# EAGLE design PCB (EAGLE 6.6.0)
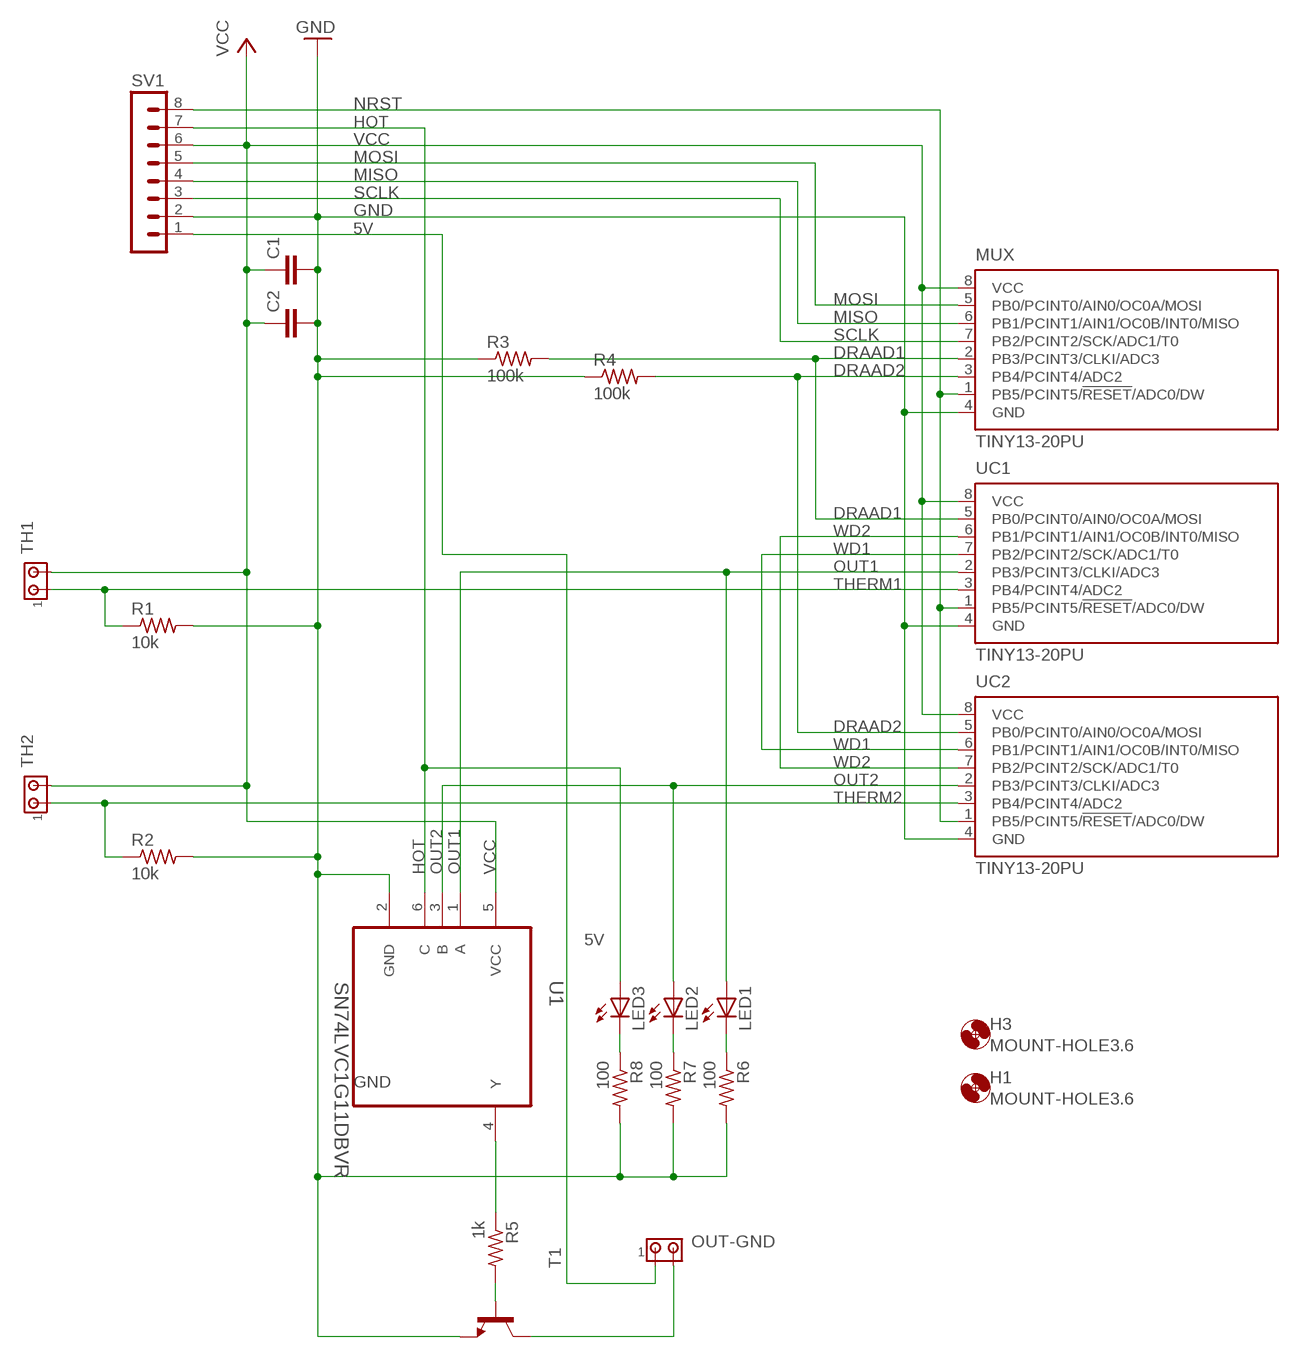
[diagram p0: schematic, sheet 1]

## Parts
C1  C2.5/2  [C2.5-2]
C2  C2.5/2  [C2.5-2]
H1  MOUNT-HOLE3.6  [3,6]
H3  MOUNT-HOLE3.6  [3,6]
LED1  LEDSML0805  [SML0805]
LED2  LEDSML0805  [SML0805]
LED3  LEDSML0805  [SML0805]
MUX  TINY13-20PU  [DIL08]
OUT-GND  MTA02-100  [10X02MTA]
R1  10k  R-US_R0805  [R0805]
R2  10k  R-US_R0805  [R0805]
R3  100k  R-US_R0805  [R0805]
R4  100k  R-US_R0805  [R0805]
R5  1k  R-US_R0805  [R0805]
R6  100  R-US_R0805  [R0805]
R7  100  R-US_R0805  [R0805]
R8  100  R-US_R0805  [R0805]
SV1  MA08-1  [MA08-1]
T1  -NPN-TO126V  [TO126V]
TH1  MTA02-100  [10X02MTA]
TH2  MTA02-100  [10X02MTA]
U1  SN74LVC1G11DBVR  [SOT95P280X145-6N]
UC1  TINY13-20PU  [DIL08]
UC2  TINY13-20PU  [DIL08]

## Nets
5V: OUT-GND.1 SV1.1
DRAAD1: MUX.2(PB3/PCINT3/CLKI/ADC3) R3.2 UC1.5(PB0/PCINT0/AIN0/OC0A/MOSI)
DRAAD2: MUX.3(PB4/PCINT4/ADC2) R4.2 UC2.5(PB0/PCINT0/AIN0/OC0A/MOSI)
GND: C1.2 C2.2 MUX.4(GND) R1.2 R2.2 R3.1 R4.1 R6.2 R7.2 R8.2 SV1.2 T1.1(E) U1.2(GND) UC1.4(GND) UC2.4(GND)
HOT: LED3.A SV1.7 U1.6(C)
MISO: MUX.6(PB1/PCINT1/AIN1/OC0B/INT0/MISO) SV1.4
MOSI: MUX.5(PB0/PCINT0/AIN0/OC0A/MOSI) SV1.5
N$1: OUT-GND.2 T1.2(C)
N$2: LED3.C R8.1
N$3: R5.1 U1.4(Y)
N$4: R5.2 T1.3(B)
N$5: LED2.C R7.1
N$6: LED1.C R6.1
NRST: MUX.1(PB5/PCINT5/!RESET!/ADC0/DW) SV1.8 UC1.1(PB5/PCINT5/!RESET!/ADC0/DW) UC2.1(PB5/PCINT5/!RESET!/ADC0/DW)
OUT1: LED1.A U1.1(A) UC1.2(PB3/PCINT3/CLKI/ADC3)
OUT2: LED2.A U1.3(B) UC2.2(PB3/PCINT3/CLKI/ADC3)
SCLK: MUX.7(PB2/PCINT2/SCK/ADC1/T0) SV1.3
THERM1: R1.1 TH1.1 UC1.3(PB4/PCINT4/ADC2)
THERM2: R2.1 TH2.1 UC2.3(PB4/PCINT4/ADC2)
VCC: C1.1 C2.1 MUX.8(VCC) SV1.6 TH1.2 TH2.2 U1.5(VCC) UC1.8(VCC) UC2.8(VCC)
WD1: UC1.7(PB2/PCINT2/SCK/ADC1/T0) UC2.6(PB1/PCINT1/AIN1/OC0B/INT0/MISO)
WD2: UC1.6(PB1/PCINT1/AIN1/OC0B/INT0/MISO) UC2.7(PB2/PCINT2/SCK/ADC1/T0)

## Library data of the parts
C1 C2 = capacitor-wima:C: CAPACITOR naming: grid - package width
H1 H3 = holes:MOUNT-HOLE: MOUNTING HOLE with drill center marker
LED1-LED3 = led:LED: LED OSRAM: - CHIPLED LG R971, LG N971, LY N971, LG Q971, LY Q971, LO R971, LY R971 LH N974, LH R974 LS Q976, LO Q976, LY Q976 LO Q996 - Hyper CHIPLED LW Q18S LB Q993, LB Q99A, LB R99A - SideLED LS A670, LO A670, LY A670, LG A670, LP A670 LB A673, LV A673, LT A673, LW A673 LH A674 LY A675 LS A676, LA A676, LO A676, LY A676, LW A676 LS A679, LY A679, LG A679 - Hyper Micro SIDELED® LS Y876, LA Y876, LO Y876, LY Y876 LT Y87S - SmartLED LW L88C, LW L88S LB L89C, LB L89S, LG L890 LS L89K, LO L89K, LY L89K LS L896, LA L896, LO L896, LY L896 - TOPLED LS T670, LO T670, LY T670, LG T670, LP T670 LSG T670, LSP T670, LSY T670, LOP T670, LYG T670 LG T671, LOG T671, LSG T671 LB T673, LV T673, LT T673, LW T673 LH T674 LS T676, LA T676, LO T676, LY T676, LB T676, LH T676, LSB T676, LW T676 LB T67C, LV T67C, LT T67C, LS T67K, LO T67K, LY T67K, LW E67C LS E67B, LA E67B, LO E67B, LY E67B, LB E67C, LV E67C, LT E67C LW T67C LS T679, LY T679, LG T679 LS T770, LO T770, LY T770, LG T770, LP T770 LB T773, LV T773, LT T773, LW T773 LH T774 LS E675, LA E675, LY E675, LS T675 LS T776, LA T776, LO T776, LY T776, LB T776 LHGB T686 LT T68C, LB T68C - Hyper Mini TOPLED® LB M676 - Mini TOPLED Santana® LG M470 LS M47K, LO M47K, LY M47K Source: http://www.osram.convergy.de LUXEON: - LUMILED® LXK2-PW12-R00, LXK2-PW12-S00, LXK2-PW14-U00, LXK2-PW14-V00 LXK2-PM12-R00, LXK2-PM12-S00, LXK2-PM14-U00 LXK2-PE12-Q00, LXK2-PE12-R00, LXK2-PE12-S00, LXK2-PE14-T00, LXK2-PE14-U00 LXK2-PB12-K00, LXK2-PB12-L00, LXK2-PB12-M00, LXK2-PB14-N00, LXK2-PB14-P00, LXK2-PB14-Q00 LXK2-PR12-L00, LXK2-PR12-M00, LXK2-PR14-Q00, LXK2-PR14-R00 LXK2-PD12-Q00, LXK2-PD12-R00, LXK2-PD12-S00 LXK2-PH12-R00, LXK2-PH12-S00 LXK2-PL12-P00, LXK2-PL12-Q00, LXK2-PL12-R00 Source: www.luxeon.com KINGBRIGHT: KA-3528ASYC Source: www.kingbright.com
MUX UC1 UC2 = atmel:TINY13: 8-bit AVR Microcontroller with 1K Bytes In-System Programmable Flash Source: http://www.atmel.com/dyn/resources/prod_documents/2535S.pdf; MPN: ATTINY13-20PU; OC_FARNELL: 9171550; OC_NEWARK: 96K6521
OUT-GND TH1 TH2 = con-amp:MTA02-100: AMP connector
R1-R8 = resistor:R-US_: RESISTOR, American symbol
SV1 = parts:MA08-1: PIN HEADER; OC_FARNELL: unknown; OC_NEWARK: unknown
T1 = transistor:*-NPN-: NPN Transistror BF959 corrected 2008.03.06
U1 = parts:SN74LVC1G11DBVR: SINGLE 3-INPUT POSITIVE-AND GATE; MPN: SN74LVC1G11DBVR; OC_FARNELL: 1607825; OC_NEWARK: 87H2655; PACKAGE: SOT-23-6; SUPPLIER: Texas Instruments

## Net classes
0 default: clearance 0.205 mm

## Board
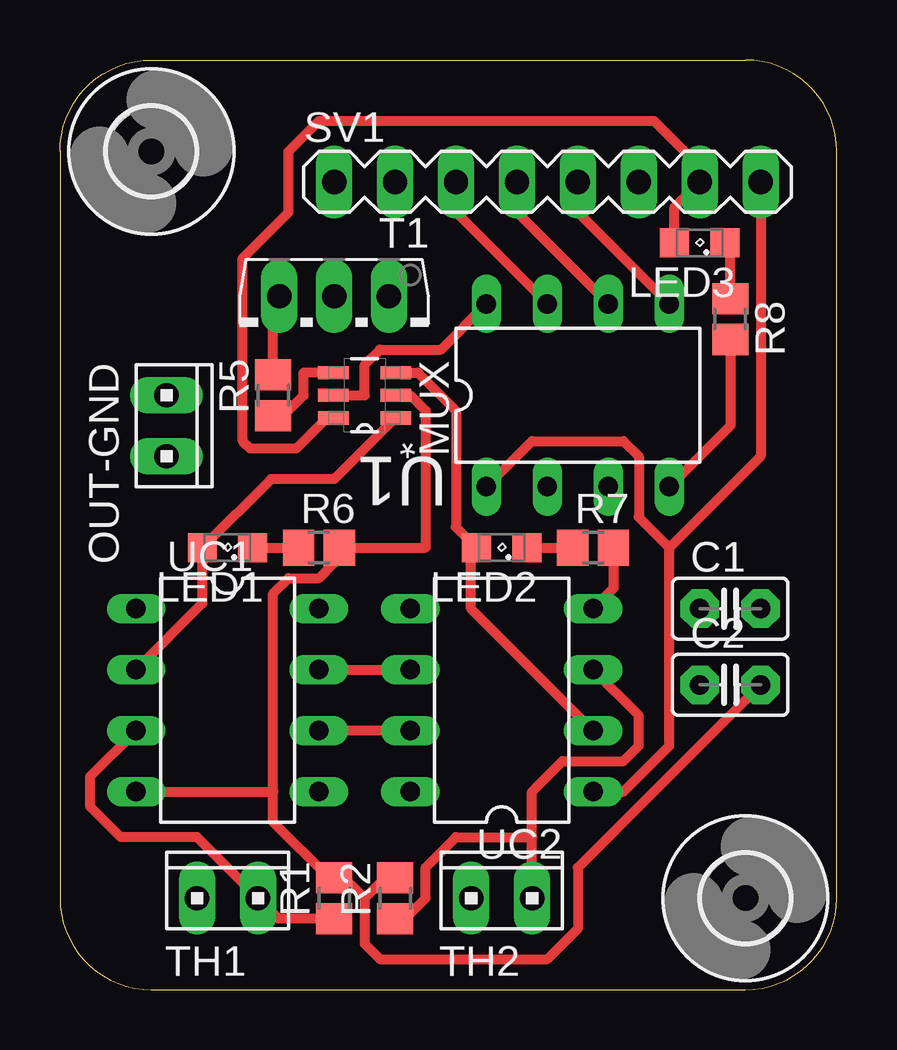
[diagram p1: board, top side]
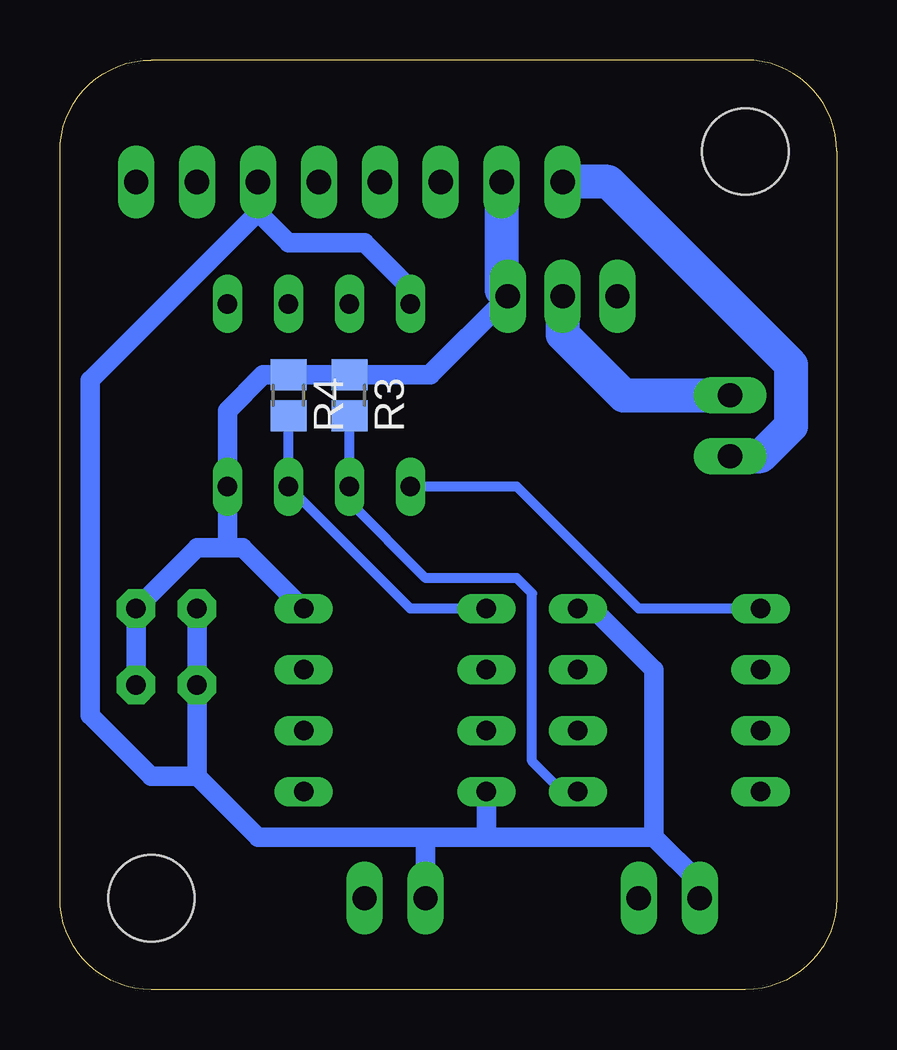
[diagram p2: board, bottom side, seen from below]

Size 32.38 x 38.73 mm. Coordinates in mm from the lower left corner, seen from the top.
Outline: 3.81,0 28.57,0 arc90 32.38,3.81 32.38,34.92 arc90 28.57,38.73 3.81,38.73 arc90 0,34.92 0,3.81 arc90 3.81,0
Copper layers (1*16): Top 0.0356mm / dielectric 1.5011mm / Bottom 0.0356mm
Design rules "oshpark-2layer": minimum track width 6mil, minimum drill 13mil, track to track 6mil, track to pad 6mil, pad to pad 6mil, via to via 6mil, smd to smd 6mil, copper to edge 15mil, drill to drill 6mil, minimum pad ring 7mil, minimum via ring 7mil, stop-mask expansion 2.5mil, vias tented up to drill 0mil, thermal gap 10mil

### Footprints (pad centres in the part's own frame; a part is rotated, then mirrored left to right if it is on the bottom)
C2.5-2 = drill 0.813 pad 1.6 octagon: 1 -1.27,0; 2 1.27,0
3,6 = hole 3.6: 0,0
SML0805 = smd 1.2 x 1.2: A 1.05,0; C -1.05,0
DIL08 = drill 0.813 long: 1 -3.81,-3.81; 2 -1.27,-3.81; 3 1.27,-3.81; 4 3.81,-3.81; 5 3.81,3.81; 6 1.27,3.81; 7 -1.27,3.81; 8 -3.81,3.81
10X02MTA = drill 1.016 long: 1 1.27,0; 2 -1.27,0
R0805 = smd 1.3 x 1.5: 1 -0.85,0; 2 0.85,0
MA08-1 = drill 1.016 long: 1 -8.89,0; 2 -6.35,0; 3 -3.81,0; 4 -1.27,0; 5 1.27,0; 6 3.81,0; 7 6.35,0; 8 8.89,0
TO126V = drill 1.016 long: 1 -2.286,-1.27; 2 0,-1.27; 3 2.286,-1.27
SOT95P280X145-6N = smd 1.27 x 0.559: 1 -1.295,0.94; 2 -1.295,0; 3 -1.295,-0.94; 4 1.295,-0.94; 5 1.295,0; 6 1.295,0.94

### Placement (x,y rotation side)
C1  27.94,15.88 0 top
C2  27.94,12.7 0 top
H1  28.57,3.81 0 top
H3  3.81,34.92 0 top
LED1  6.99,18.41 180 top
LED2  18.41,18.41 180 top
LED3  26.67,31.11 180 top
MUX  21.59,24.77 0 top
OUT-GND  4.45,23.5 270 top
R1  11.43,3.81 90 top
R2  13.97,3.81 90 top
R3  20.32,24.77 270 bottom
R4  22.86,24.77 270 bottom
R5  8.89,24.77 90 top
R6  10.79,18.41 0 top
R7  22.23,18.41 0 top
R8  27.94,27.94 270 top
SV1  20.32,33.66 0 top
T1  11.43,27.62 180 top
TH1  6.99,3.81 0 top
TH2  18.41,3.81 0 top
U1  12.7,24.77 180 top
UC1  6.99,12.06 270 top
UC2  18.41,12.06 90 top

### Tracks (layer width: path | path; a pad name or v marks a point on that pad's centre or on a via)
5V
  Bottom 1.422: OUT-GND.1 3.17,22.23 1.91,23.5 1.91,26.04 9.53,33.66 SV1.1
DRAAD1
  Bottom 0.406: R3.2 MUX.2 20.32,20.32 17.14,17.14 13.34,17.14 12.7,16.51 12.7,9.53 11.43,8.26 UC1.5
DRAAD2
  Bottom 0.406: R4.2 MUX.3 17.78,15.88 UC2.5
GND
  Top 0.406: 11.75,18.52 R6.2 | U1.2 14.61,24.77 15.24,24.13 15.24,18.41 R6.2 | R8.2 27.94,23.5 MUX.4 | R7.2 23.07,16.73 UC2.4 | 8.89,8.26 8.89,6.99 11.21,4.66 R1.2 11.85,4.66 12.7,3.81 | 8.89,8.26 8.89,16.51 9.53,17.14 10.79,17.14 11.43,17.78 11.43,18.2 R6.2 | 12.7,3.81 12.7,1.91 13.34,1.27 20.32,1.27 21.59,2.54 21.59,5.08 C2.2 | 12.7,3.81 13.34,4.45 13.76,4.45 R2.2 | UC1.4 8.89,8.26
  Bottom 0.813: R3.1 16.99,25.61 | 16.99,25.61 T1.1 | R3.1 R4.1 | 25.4,18.41 24.77,18.41 UC2.4 | 25.4,18.41 MUX.4 25.4,24.13 23.91,25.61 R3.1 | 16.99,25.61 16.93,25.61 13.97,28.57 | C2.2 C1.2 26.67,18.41 25.4,18.41
  Bottom 1.422: SV1.2 13.97,29.15 T1.1
HOT
  Top 0.406: U1.6 11.12,23.82 9.84,22.54 7.94,22.54 7.62,22.86 7.62,30.48 9.53,32.38 9.53,34.92 10.79,36.2 24.77,36.2 26.67,34.29 SV1.7 25.62,32.6 LED3.A
MISO
  Top 0.406: SV1.4 19.05,32.38 MUX.6
MOSI
  Top 0.406: SV1.5 21.59,32.38 MUX.5
N$1
  Bottom 1.422: T1.2 11.43,27.3 8.89,24.77 OUT-GND.2
N$2
  Top 0.406: R8.1 27.94,30.89 LED3.C
N$3
  Top 0.406: R5.1 9.31,23.91 10.16,24.77 10.16,25.72 11.39,25.72 U1.4
N$4
  Top 0.406: R5.2 8.89,28.64 T1.3
N$5
  Top 0.406: LED2.C R7.1
N$6
  Top 0.406: LED1.C R6.1
NRST
  Top 0.406: MUX.1 19.68,22.86 23.5,22.86 24.13,22.23 24.13,19.68 25.4,18.41 | UC2.1 23.5,8.26 25.4,10.16 25.4,18.41 | SV1.8 29.21,22.23 25.4,18.41
  Bottom 0.406: UC1.1 8.26,15.88 13.34,20.95 MUX.1
OUT1
  Top 0.406: U1.1 13.98,23.82 11.43,21.27 8.79,21.27 LED1.A 5.93,16.09 UC1.2
OUT2
  Top 0.406: U1.3 14.94,25.7 16.51,24.13 16.51,19.27 LED2.A | 17.14,18.64 LED2.A | UC2.2 17.14,15.88 17.14,18.2 LED2.A
SCLK
  Top 0.406: SV1.3 16.51,32.38 MUX.7
THERM1
  Top 0.406: R1.1 9.11,2.96 TH1.1 5.71,6.35 2.54,6.35 1.27,7.62 1.27,8.89 UC1.3
THERM2
  Top 0.406: R2.1 13.97,2.54 15.24,3.81 15.24,5.08 16.51,6.35 19.68,6.35 | TH2.1 19.68,6.35 | 19.68,6.35 19.68,8.26 20.95,9.53 23.5,9.53 24.13,10.16 24.13,11.43 UC2.3
VCC
  Top 0.406: U1.5 12.7,24.77 12.7,26.04 13.34,26.67 15.88,26.67 MUX.8
  Bottom 0.813: SV1.6 24.13,32.38 | 24.13,32.38 22.86,31.11 19.68,31.11 17.78,29.21 MUX.8 | 17.14,6.35 24.13,6.35 26.67,8.89 | TH2.2 17.14,6.35 | 17.14,6.35 14.61,6.35 | 14.61,6.35 7.62,6.35 | 7.62,6.35 5.71,4.45 TH1.2 | 24.13,32.38 31.11,25.4 31.11,11.43 28.57,8.89 26.67,8.89 | UC2.8 14.61,6.35 | UC1.8 10.16,15.88 7.62,13.34 7.62,6.35 | C1.1 C2.1 26.67,8.89
WD1
  Top 0.406: UC1.7 UC2.6
WD2
  Top 0.406: UC2.7 UC1.6

### Text on the board
tOrigins: 5V | GND | SCLK | MISO | MOSI | VCC | HOT | nRST | 1k | 1k | rev B | MUX | OUT | 1k | 1k | Bart2 | github.com/bwesterb/bart2 | uC1 | uC2 | 10k | 10k | TH1 | TH2
bOrigins: 100k